# EAGLE design MODUL_RELAIS_8_V101 (EAGLE 6.4)

## Sheet 1 of 2
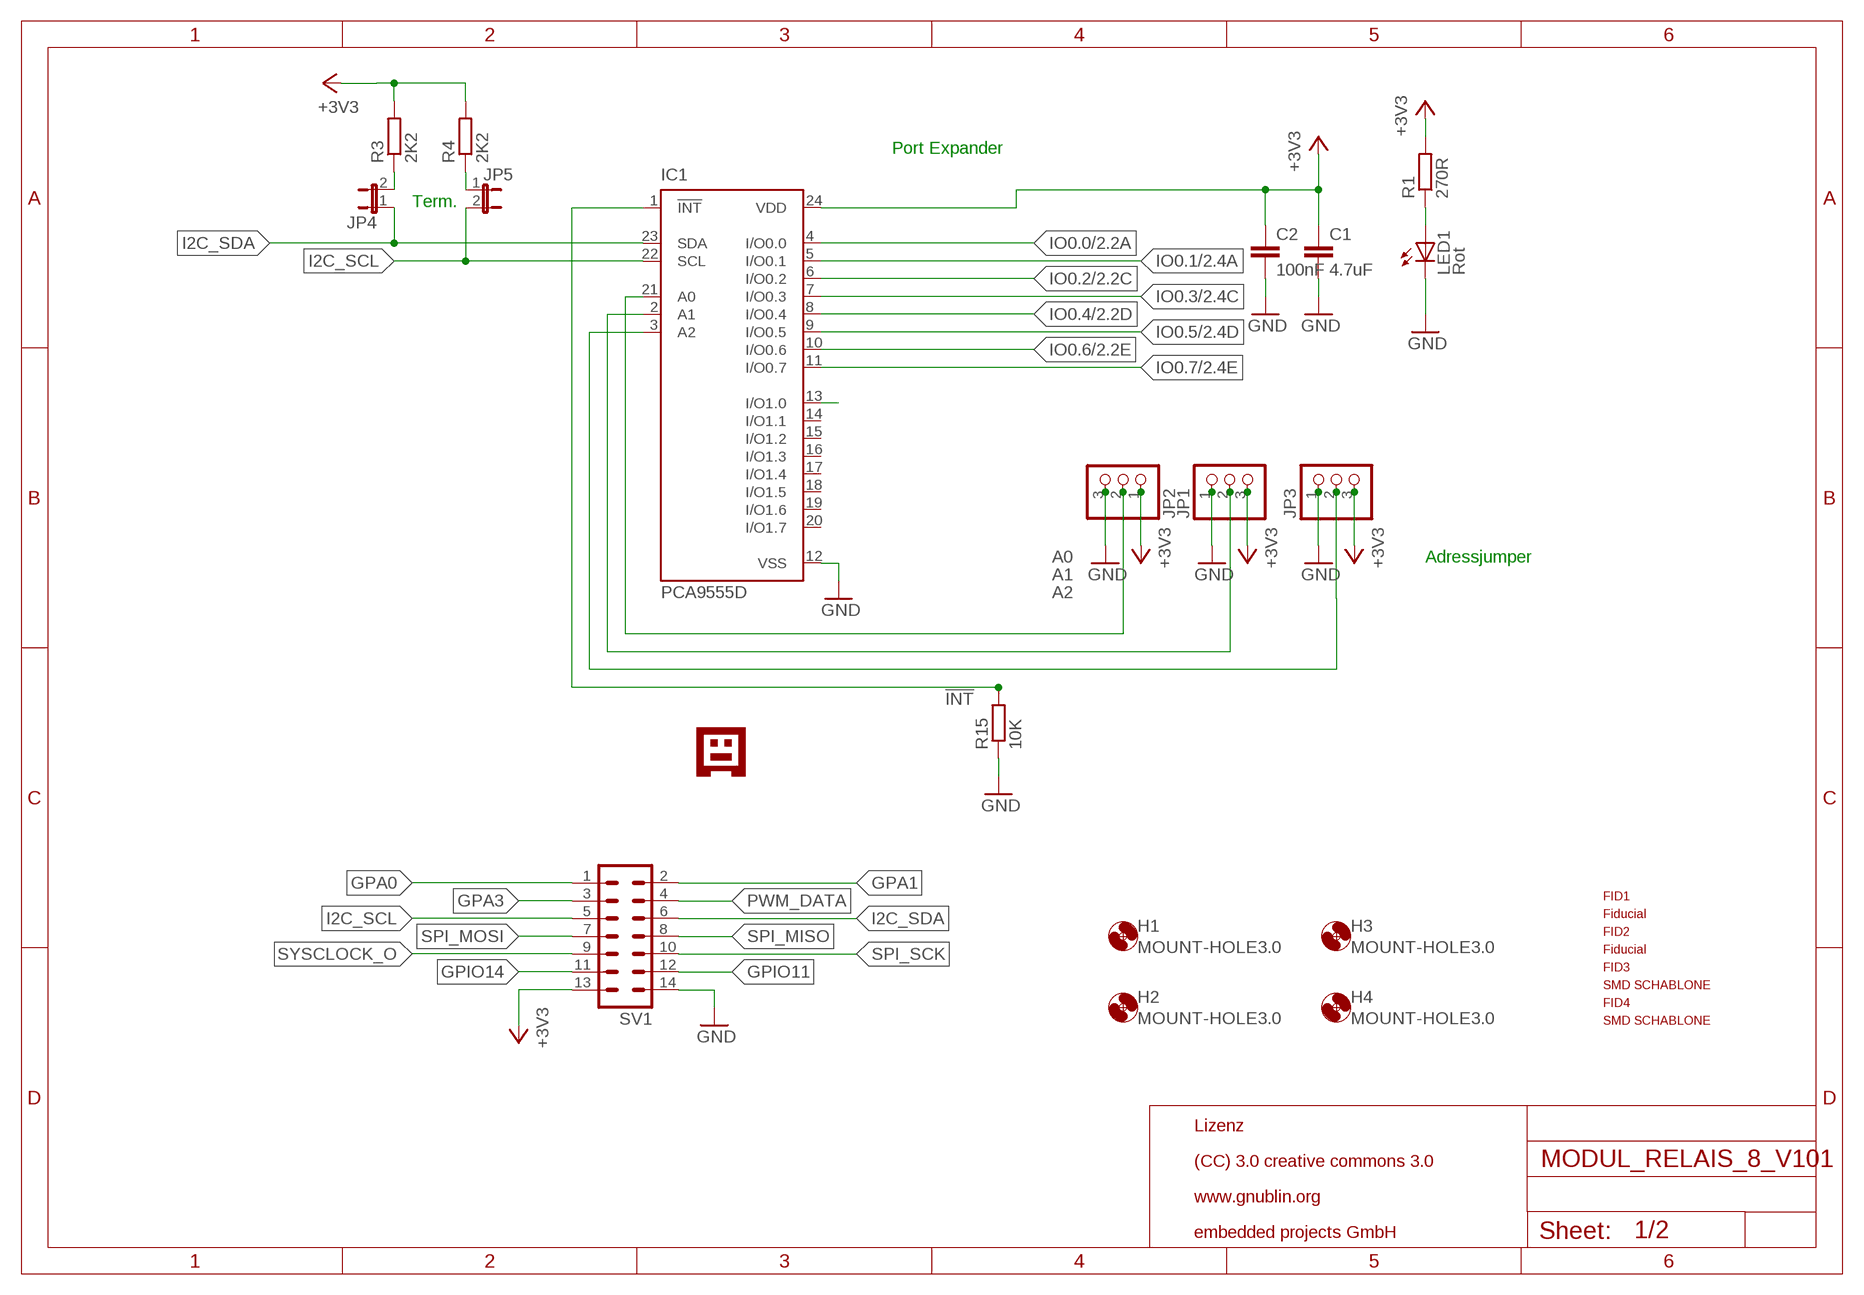
[diagram p0: schematic, sheet 1]

### Parts
C1  4.7uF  C-EUC0805  [C0805]
C2  100nF  C-EUC0805  [C0805]
FID1  PASSERMARKEN_FIDUCIAL  [PASSERMARKEN_FIDUCIAL]
FID2  PASSERMARKEN_FIDUCIAL  [PASSERMARKEN_FIDUCIAL]
FID3  PASSERMARKEN_FIDUCIAL  [PASSERMARKEN_FIDUCIAL]
FID4  PASSERMARKEN_FIDUCIAL  [PASSERMARKEN_FIDUCIAL]
H1  MOUNT-HOLE3.0  [3,0]
H2  MOUNT-HOLE3.0  [3,0]
H3  MOUNT-HOLE3.0  [3,0]
H4  MOUNT-HOLE3.0  [3,0]
IC1  PCA9555D  [SO24]
JP1  PINHD-1X3  [1X03]
JP2  PINHD-1X3  [1X03]
JP3  PINHD-1X3  [1X03]
JP4  JP1E  [JP1]
JP5  JP1E  [JP1]
LED1  Rot  LEDCHIP-LED0805  [CHIP-LED0805]
R1  270R  R-EU_R0805  [R0805]
R3  2K2  R-EU_R0805  [R0805]
R4  2K2  R-EU_R0805  [R0805]
R15  10K  R-EU_R0805  [R0805]
SV1  ML14  [ML14]
U$1  GNUBLINLOGOSIEB  [GNUSIEBDRUCK]

### Nets
!INT: IC1.1(!INT) R15.2
+3V3: C1.1 C2.1 IC1.24(VDD) JP1.3 JP2.1 JP3.3 R1.2 R3.2 R4.2 SV1.13 ; also sheet 2
A0: IC1.21(A0) JP2.2
A1: IC1.2(A1) JP1.2
A2: IC1.3(A2) JP3.2
GND: C1.2 C2.2 IC1.12(VSS) JP1.1 JP2.3 JP3.1 LED1.C R15.1 SV1.14 ; also sheet 2
GPA0: SV1.1
GPA1: SV1.2
GPA3: SV1.3
GPIO11: SV1.12
GPIO14: SV1.11
I2C_SCL: IC1.22(SCL) JP5.2 SV1.5
I2C_SDA: IC1.23(SDA) JP4.1 SV1.6
IO0.0: IC1.4(I/O0.0) ; also sheet 2
IO0.1: IC1.5(I/O0.1) ; also sheet 2
IO0.2: IC1.6(I/O0.2) ; also sheet 2
IO0.3: IC1.7(I/O0.3) ; also sheet 2
IO0.4: IC1.8(I/O0.4) ; also sheet 2
IO0.5: IC1.9(I/O0.5) ; also sheet 2
IO0.6: IC1.10(I/O0.6) ; also sheet 2
IO0.7: IC1.11(I/O0.7) ; also sheet 2
IO1.0: IC1.13(I/O1.0)
N$1: JP4.2 R3.1
N$2: LED1.A R1.1
N$5: JP5.1 R4.1
PWM_DATA: SV1.4
SPI_MISO: SV1.8
SPI_MOSI: SV1.7
SPI_SCK: SV1.10
SYSCLOCK_O: SV1.9
Unconnected: IC1.14(I/O1.1) IC1.15(I/O1.2) IC1.16(I/O1.3) IC1.17(I/O1.4) IC1.18(I/O1.5) IC1.19(I/O1.6) IC1.20(I/O1.7)

### Notes on the sheet
- Port Expander
- Term.
- Adressjumper
- Lizenz
- (CC) 3.0 creative commons 3.0
- www.gnublin.org
- embedded projects GmbH

## Sheet 2 of 2
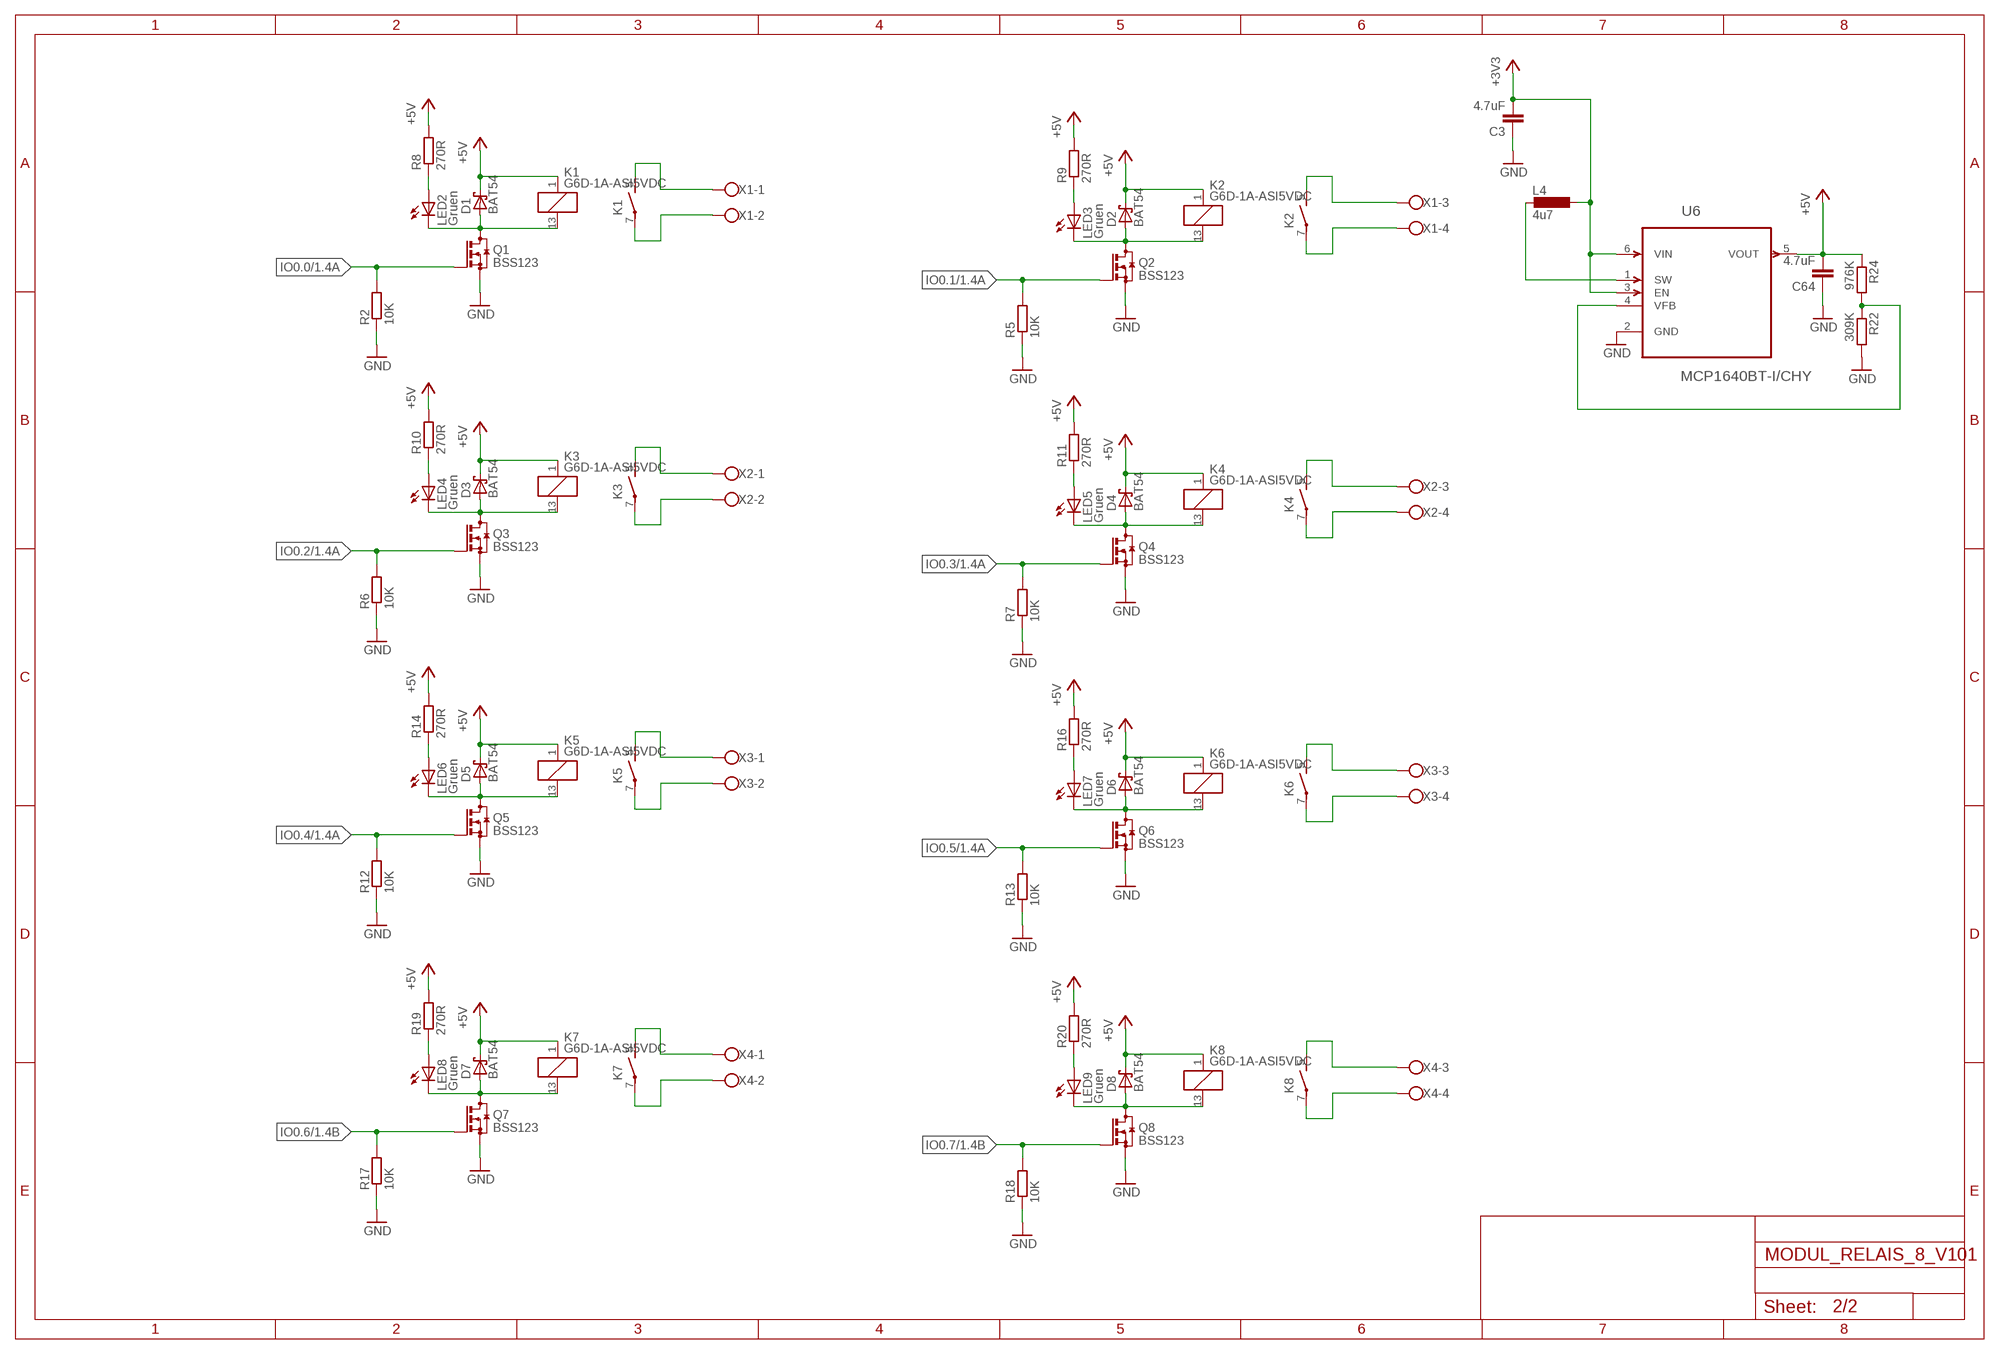
[diagram p1: schematic, sheet 2]

### Parts
C3  4.7uF  C-EUC0805  [C0805]
C64  4.7uF  C-EUC0805  [C0805]
D1  BAT54  DIODE_BAT54  [DIODE_SOT23]
D2  BAT54  DIODE_BAT54  [DIODE_SOT23]
D3  BAT54  DIODE_BAT54  [DIODE_SOT23]
D4  BAT54  DIODE_BAT54  [DIODE_SOT23]
D5  BAT54  DIODE_BAT54  [DIODE_SOT23]
D6  BAT54  DIODE_BAT54  [DIODE_SOT23]
D7  BAT54  DIODE_BAT54  [DIODE_SOT23]
D8  BAT54  DIODE_BAT54  [DIODE_SOT23]
K1  G6D-1A-ASI5VDC  RELAY_G6D-1A-ASI5VDC  [RELAY_G6D]
K2  G6D-1A-ASI5VDC  RELAY_G6D-1A-ASI5VDC  [RELAY_G6D]
K3  G6D-1A-ASI5VDC  RELAY_G6D-1A-ASI5VDC  [RELAY_G6D]
K4  G6D-1A-ASI5VDC  RELAY_G6D-1A-ASI5VDC  [RELAY_G6D]
K5  G6D-1A-ASI5VDC  RELAY_G6D-1A-ASI5VDC  [RELAY_G6D]
K6  G6D-1A-ASI5VDC  RELAY_G6D-1A-ASI5VDC  [RELAY_G6D]
K7  G6D-1A-ASI5VDC  RELAY_G6D-1A-ASI5VDC  [RELAY_G6D]
K8  G6D-1A-ASI5VDC  RELAY_G6D-1A-ASI5VDC  [RELAY_G6D]
L4  4u7  PSU3014  [PSU3014]
LED2  Gruen  LEDCHIP-LED0805  [CHIP-LED0805]
LED3  Gruen  LEDCHIP-LED0805  [CHIP-LED0805]
LED4  Gruen  LEDCHIP-LED0805  [CHIP-LED0805]
LED5  Gruen  LEDCHIP-LED0805  [CHIP-LED0805]
LED6  Gruen  LEDCHIP-LED0805  [CHIP-LED0805]
LED7  Gruen  LEDCHIP-LED0805  [CHIP-LED0805]
LED8  Gruen  LEDCHIP-LED0805  [CHIP-LED0805]
LED9  Gruen  LEDCHIP-LED0805  [CHIP-LED0805]
Q1  BSS123  TRANSISTOR-SMALL-SIGNAL_BSS123  [TRANSISTOR-SMALL-SIGNAL_SOT23]
Q2  BSS123  TRANSISTOR-SMALL-SIGNAL_BSS123  [TRANSISTOR-SMALL-SIGNAL_SOT23]
Q3  BSS123  TRANSISTOR-SMALL-SIGNAL_BSS123  [TRANSISTOR-SMALL-SIGNAL_SOT23]
Q4  BSS123  TRANSISTOR-SMALL-SIGNAL_BSS123  [TRANSISTOR-SMALL-SIGNAL_SOT23]
Q5  BSS123  TRANSISTOR-SMALL-SIGNAL_BSS123  [TRANSISTOR-SMALL-SIGNAL_SOT23]
Q6  BSS123  TRANSISTOR-SMALL-SIGNAL_BSS123  [TRANSISTOR-SMALL-SIGNAL_SOT23]
Q7  BSS123  TRANSISTOR-SMALL-SIGNAL_BSS123  [TRANSISTOR-SMALL-SIGNAL_SOT23]
Q8  BSS123  TRANSISTOR-SMALL-SIGNAL_BSS123  [TRANSISTOR-SMALL-SIGNAL_SOT23]
R2  10K  R-EU_R0805  [R0805]
R5  10K  R-EU_R0805  [R0805]
R6  10K  R-EU_R0805  [R0805]
R7  10K  R-EU_R0805  [R0805]
R8  270R  R-EU_R0805  [R0805]
R9  270R  R-EU_R0805  [R0805]
R10  270R  R-EU_R0805  [R0805]
R11  270R  R-EU_R0805  [R0805]
R12  10K  R-EU_R0805  [R0805]
R13  10K  R-EU_R0805  [R0805]
R14  270R  R-EU_R0805  [R0805]
R16  270R  R-EU_R0805  [R0805]
R17  10K  R-EU_R0805  [R0805]
R18  10K  R-EU_R0805  [R0805]
R19  270R  R-EU_R0805  [R0805]
R20  270R  R-EU_R0805  [R0805]
R22  309K  R-EU_R0805  [R0805]
R24  976K  R-EU_R0805  [R0805]
U6  MCP1640BT-I/CHY  [SOT95P270X145-6N]
X1  W237-04P  [W237-4P]
X2  W237-04P  [W237-4P]
X3  W237-04P  [W237-4P]
X4  W237-04P  [W237-4P]

### Nets
+3V3: C3.2 L4.2 U6.3(EN) U6.6(VIN) ; also sheet 1
+5V: C64.2 D1.3(C) D2.3(C) D3.3(C) D4.3(C) D5.3(C) D6.3(C) D7.3(C) D8.3(C) K1.1 K2.1 K3.1 K4.1 K5.1 K6.1 K7.1 K8.1 R8.2 R9.2 R10.2 R11.2 R14.2 R16.2 R19.2 R20.2 R24.1 U6.5(VOUT)
ENABLE_5V: L4.1 U6.1(SW)
GND: C3.1 C64.1 Q1.2(S) Q2.2(S) Q3.2(S) Q4.2(S) Q5.2(S) Q6.2(S) Q7.2(S) Q8.2(S) R2.1 R5.1 R6.1 R7.1 R12.1 R13.1 R17.1 R18.1 R22.2 U6.2(GND) ; also sheet 1
IO0.0: Q1.1(G) R2.2 ; also sheet 1
IO0.1: Q2.1(G) R5.2 ; also sheet 1
IO0.2: Q3.1(G) R6.2 ; also sheet 1
IO0.3: Q4.1(G) R7.2 ; also sheet 1
IO0.4: Q5.1(G) R12.2 ; also sheet 1
IO0.5: Q6.1(G) R13.2 ; also sheet 1
IO0.6: Q7.1(G) R17.2 ; also sheet 1
IO0.7: Q8.1(G) R18.2 ; also sheet 1
N$3: D1.1(A) K1.13 LED2.C Q1.3(D)
N$4: LED2.A R8.1
N$6: D2.1(A) K2.13 LED3.C Q2.3(D)
N$7: LED3.A R9.1
N$8: K1.5(2:S) X1.1
N$9: K1.7(2:P) X1.2
N$10: K2.5(2:S) X1.3
N$11: K2.7(2:P) X1.4
N$12: D3.1(A) K3.13 LED4.C Q3.3(D)
N$13: D4.1(A) K4.13 LED5.C Q4.3(D)
N$14: LED4.A R10.1
N$15: LED5.A R11.1
N$16: K3.5(2:S) X2.1
N$17: K3.7(2:P) X2.2
N$18: K4.5(2:S) X2.3
N$19: K4.7(2:P) X2.4
N$20: D5.1(A) K5.13 LED6.C Q5.3(D)
N$21: D6.1(A) K6.13 LED7.C Q6.3(D)
N$22: LED6.A R14.1
N$23: LED7.A R16.1
N$24: K5.5(2:S) X3.1
N$25: K5.7(2:P) X3.2
N$26: K6.5(2:S) X3.3
N$27: K6.7(2:P) X3.4
N$28: D7.1(A) K7.13 LED8.C Q7.3(D)
N$29: D8.1(A) K8.13 LED9.C Q8.3(D)
N$30: LED8.A R19.1
N$31: LED9.A R20.1
N$32: K7.5(2:S) X4.1
N$33: K7.7(2:P) X4.2
N$34: K8.5(2:S) X4.3
N$35: K8.7(2:P) X4.4
N$50: R22.1 R24.2 U6.4(VFB)

## Library data of the parts
C1-C3 C64 = rcl:C-EU: CAPACITOR, European symbol
D1-D8 = 20110426_ECP_XMEGABOARD_V102:DIODE_BAT54: Schottky Diodes Source: Fairchild .. BAT54.pdf
FID1 FID2 = KUBUS3:PASSERMARKEN_FIDUCIAL: SMD Passermarke
FID3 FID4 = SMDSCHABLONE:PASSERMARKEN_FIDUCIAL: SMD Passermarke
H1-H4 = holes:MOUNT-HOLE: MOUNTING HOLE with drill center marker
IC1 = micro-philips:PCA9555: 16-bit I2C and SMBus I/O port with interrupt Source: PCA9555_5.pdf; MPN: PCA9555DW; OC_FARNELL: 8906076; OC_NEWARK: 63K6067
JP1-JP3 = pinhead:PINHD-1X3: PIN HEADER
JP4 JP5 = jumper:JP1E: JUMPER
K1-K8 = 20110426_ECP_XMEGABOARD_V102:RELAY_G6D?*: OMRON Slim, Miniature PCB Relay 17.5 × 6.5 × 12.5 mm with Socked Source: http://ecb.omron.com.sg/pdf/relay/power/G6D.pdf; OC_FARNELL: 9812660; OC_NEWARK: unknown
L4 = KUBUS3B_PARTS2:PSU3014: SMD Power Inductors Shielded
LED1-LED9 = led:LED: LED OSRAM: - CHIPLED LG R971, LG N971, LY N971, LG Q971, LY Q971, LO R971, LY R971 LH N974, LH R974 LS Q976, LO Q976, LY Q976 LO Q996 - Hyper CHIPLED LW Q18S LB Q993, LB Q99A, LB R99A - SideLED LS A670, LO A670, LY A670, LG A670, LP A670 LB A673, LV A673, LT A673, LW A673 LH A674 LY A675 LS A676, LA A676, LO A676, LY A676, LW A676 LS A679, LY A679, LG A679 - Hyper Micro SIDELED® LS Y876, LA Y876, LO Y876, LY Y876 LT Y87S - SmartLED LW L88C, LW L88S LB L89C, LB L89S, LG L890 LS L89K, LO L89K, LY L89K LS L896, LA L896, LO L896, LY L896 - TOPLED LS T670, LO T670, LY T670, LG T670, LP T670 LSG T670, LSP T670, LSY T670, LOP T670, LYG T670 LG T671, LOG T671, LSG T671 LB T673, LV T673, LT T673, LW T673 LH T674 LS T676, LA T676, LO T676, LY T676, LB T676, LH T676, LSB T676, LW T676 LB T67C, LV T67C, LT T67C, LS T67K, LO T67K, LY T67K, LW E67C LS E67B, LA E67B, LO E67B, LY E67B, LB E67C, LV E67C, LT E67C LW T67C LS T679, LY T679, LG T679 LS T770, LO T770, LY T770, LG T770, LP T770 LB T773, LV T773, LT T773, LW T773 LH T774 LS E675, LA E675, LY E675, LS T675 LS T776, LA T776, LO T776, LY T776, LB T776 LHGB T686 LT T68C, LB T68C - Hyper Mini TOPLED® LB M676 - Mini TOPLED Santana® LG M470 LS M47K, LO M47K, LY M47K Source: http://www.osram.convergy.de LUXEON: - LUMILED® LXK2-PW12-R00, LXK2-PW12-S00, LXK2-PW14-U00, LXK2-PW14-V00 LXK2-PM12-R00, LXK2-PM12-S00, LXK2-PM14-U00 LXK2-PE12-Q00, LXK2-PE12-R00, LXK2-PE12-S00, LXK2-PE14-T00, LXK2-PE14-U00 LXK2-PB12-K00, LXK2-PB12-L00, LXK2-PB12-M00, LXK2-PB14-N00, LXK2-PB14-P00, LXK2-PB14-Q00 LXK2-PR12-L00, LXK2-PR12-M00, LXK2-PR14-Q00, LXK2-PR14-R00 LXK2-PD12-Q00, LXK2-PD12-R00, LXK2-PD12-S00 LXK2-PH12-R00, LXK2-PH12-S00 LXK2-PL12-P00, LXK2-PL12-Q00, LXK2-PL12-R00 Source: www.luxeon.com KINGBRIGHT: KA-3528ASYC Source: www.kingbright.com
Q1-Q8 = 20110426_ECP_XMEGABOARD_V102:TRANSISTOR-SMALL-SIGNAL_BSS123: N-CHANNEL MOS FET
R1-R20 R22 R24 = rcl:R-EU_: RESISTOR, European symbol
SV1 = con-ml:ML14: HARTING; OC_FARNELL: unknown; OC_NEWARK: unknown
U6 = mcp1640:MCP1640BT-I/CHY: Synchronous Boost Regulator; MPN: MCP1640BT-I/CHY; OC_FARNELL: 1800207; OC_NEWARK: 73R3625; PACKAGE: SOT-6; SUPPLIER: Microchip
U$1 = EmbeddedProjectsLogos2:GNUBLINLOGO
X1-X4 = con-wago-508:W237-04P: WAGO SREW CLAMP

## Net classes
2 5V: width 0.2 mm, clearance 0.15 mm

## Board
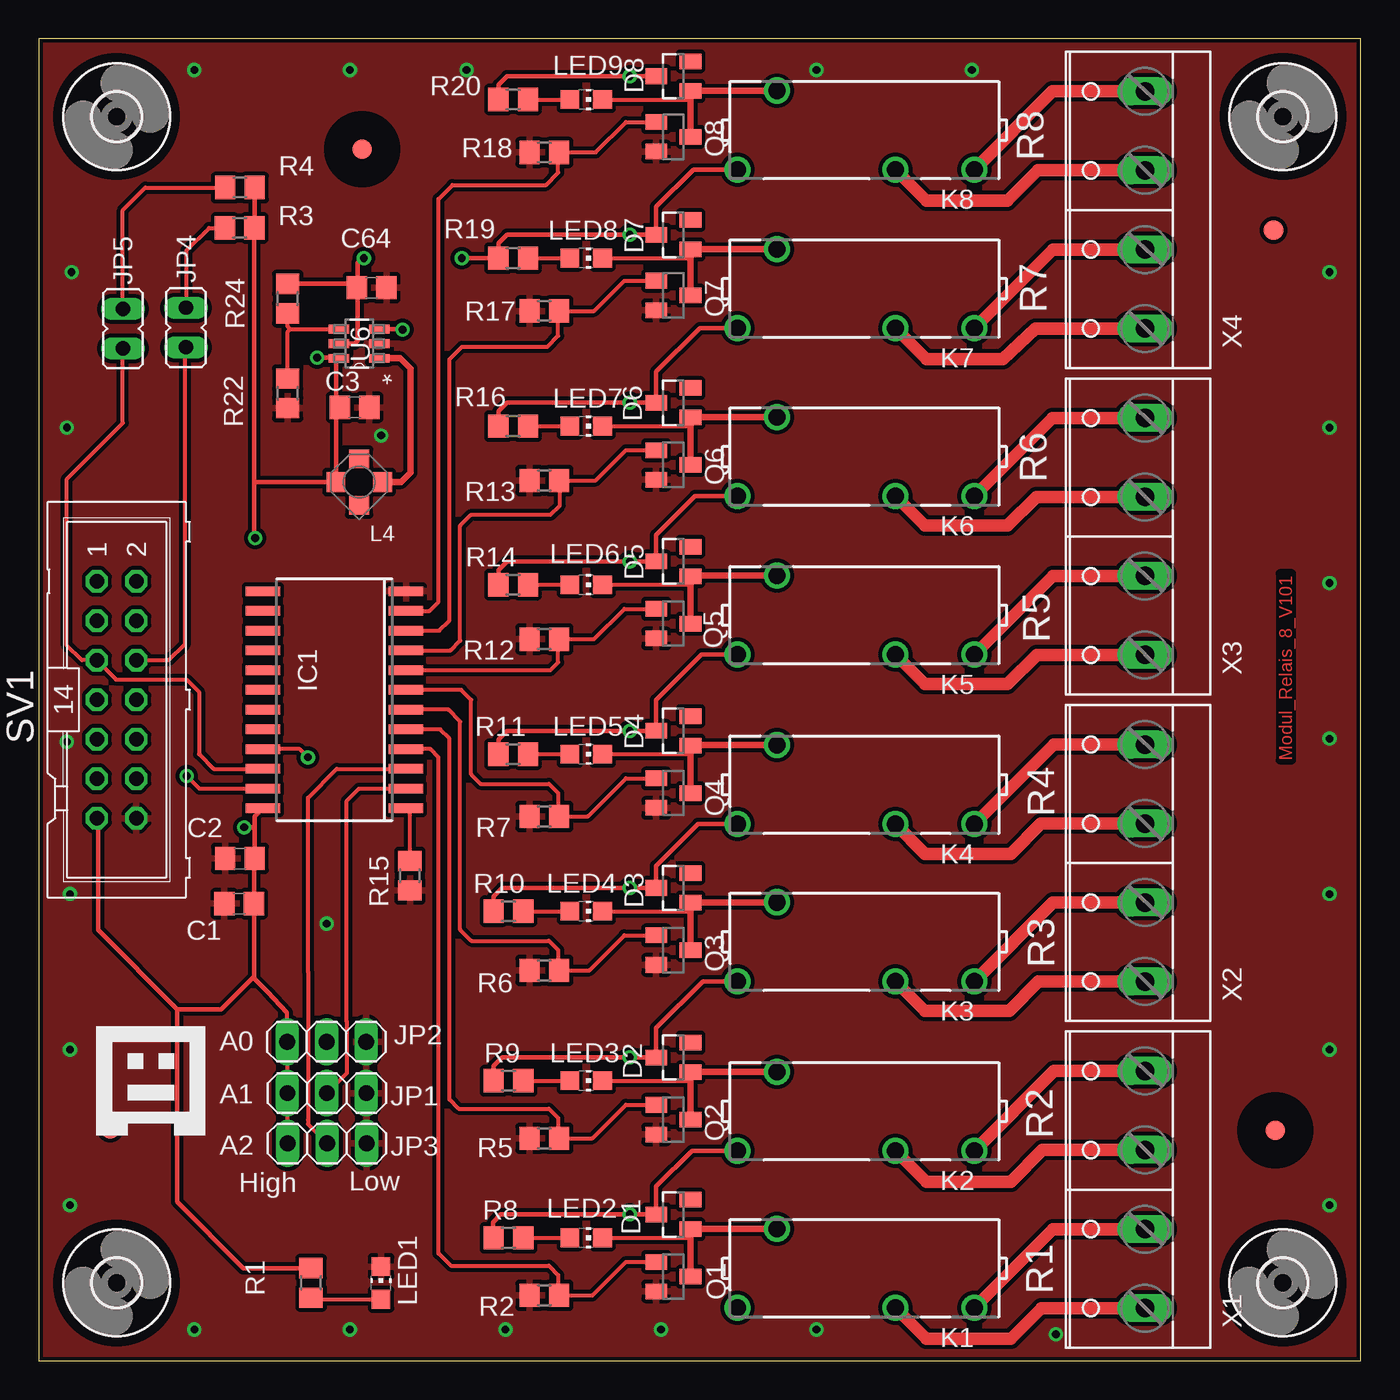
[diagram p2: board, top side]
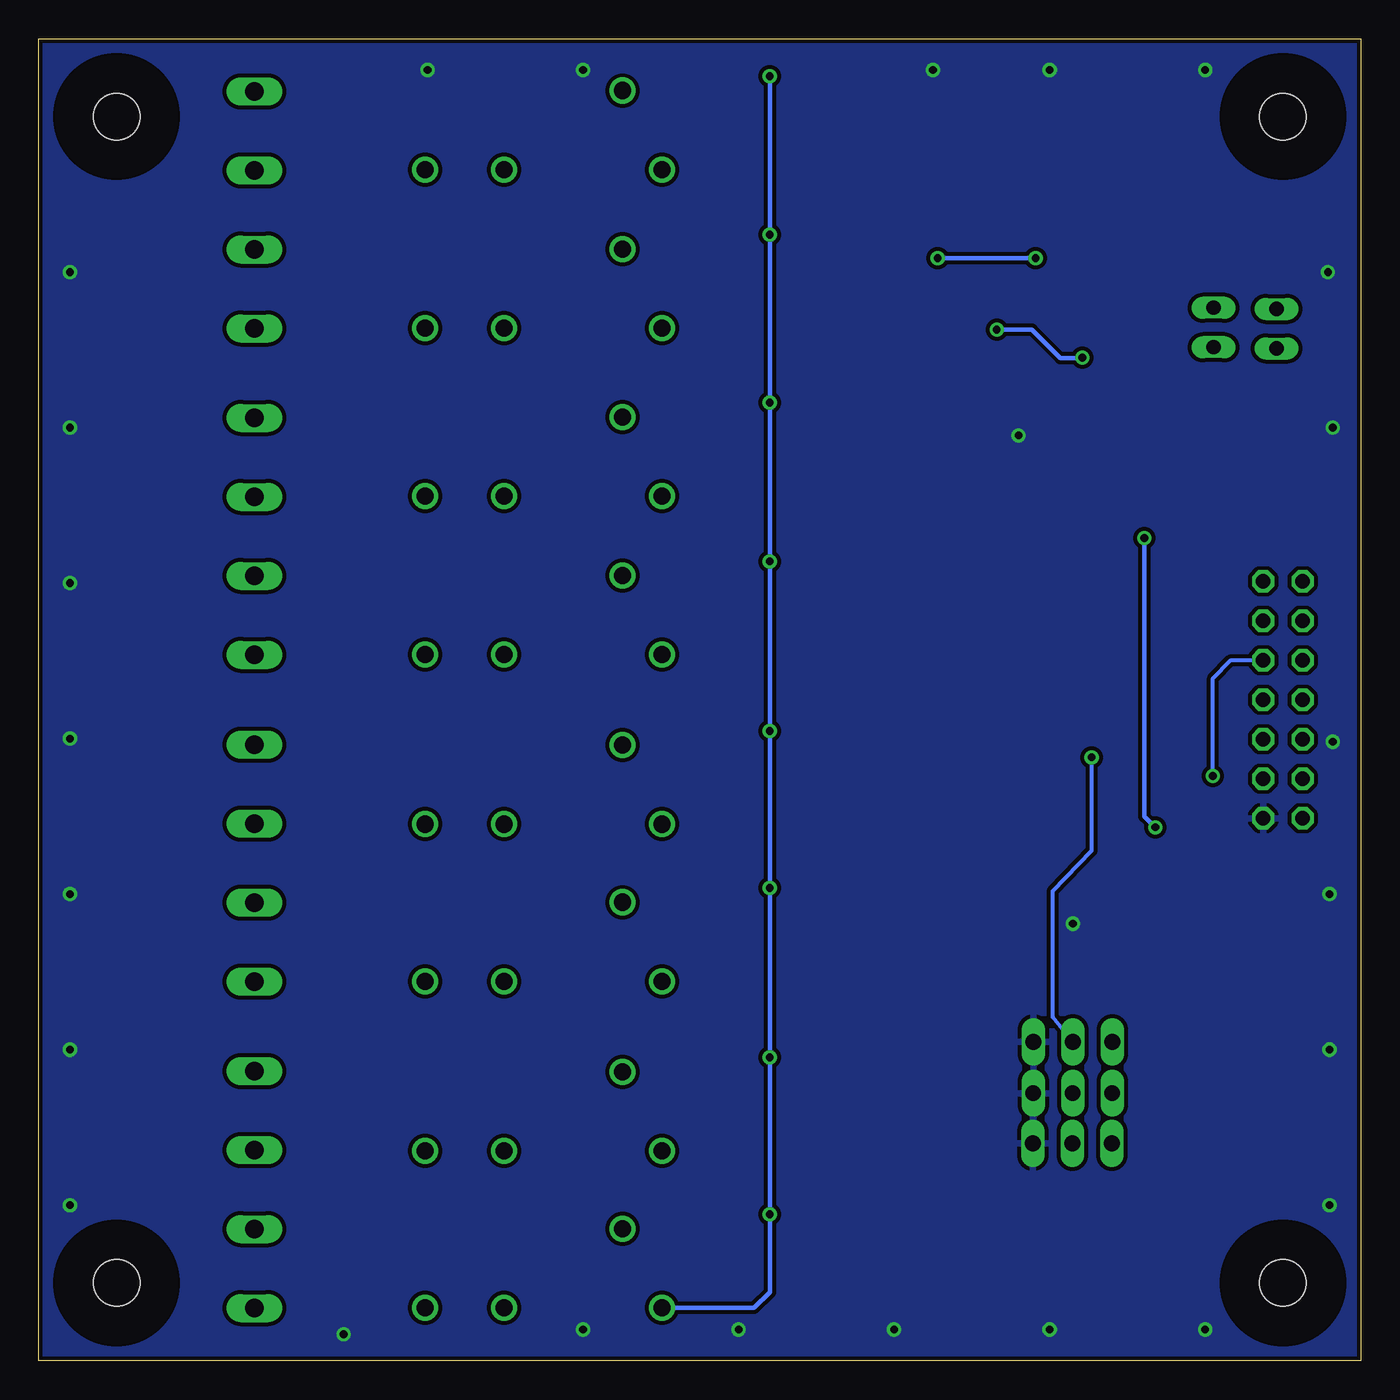
[diagram p3: board, bottom side, seen from below]

Size 85 x 85 mm. Coordinates in mm from the lower left corner, seen from the top.
Outline: 0,0 85,0 85,85 0,85 0,0
Copper layers (1*16): Top 0.035mm / dielectric 1.5mm / Bottom 0.035mm
Design rules "default *": minimum track width 10mil, minimum drill 24mil, track to track 10mil, track to pad 10mil, pad to pad 10mil, via to via 10mil, smd to smd 8mil, copper to edge 10mil, drill to drill 8mil, minimum pad ring 10mil, minimum via ring 8mil, stop-mask expansion 2mil, vias tented up to drill 40mil, thermal gap 10mil

### Footprints (pad centres in the part's own frame; a part is rotated, then mirrored left to right if it is on the bottom)
C0805 = smd 1.3 x 1.5: 1 -0.95,0; 2 0.95,0
DIODE_SOT23 = smd 1 x 1.4: 1 -0.95,-1.1; 2 0.95,-1.1; 3 0,1.1
PASSERMARKEN_FIDUCIAL = smd 1.27 x 1.27: 1 0,0
3,0 = hole 3: 0,0
SO24 = smd 0.6 x 2.2: 1 -6.985,-4.6; 2 -5.715,-4.6; 3 -4.445,-4.6; 4 -3.175,-4.6; 5 -1.905,-4.6; 6 -0.635,-4.6; 7 0.635,-4.6; 8 1.905,-4.6; 9 3.175,-4.6; 10 4.445,-4.6; 11 5.715,-4.6; 12 6.985,-4.6; 13 6.985,4.6; 14 5.715,4.6; 15 4.445,4.6; 16 3.175,4.6; 17 1.905,4.6; 18 0.635,4.6; 19 -0.635,4.6; 20 -1.905,4.6; 21 -3.175,4.6; 22 -4.445,4.6; 23 -5.715,4.6; 24 -6.985,4.6
1X03 = drill 1.016 long: 1 -2.54,0; 2 0,0; 3 2.54,0
JP1 = drill 0.914 long: 1 0,-1.27; 2 0,1.27
RELAY_G6D = drill 1.1 pad 1.676: 1 8.08,2.5; 5 -2.08,2.5; 7 -7.16,2.5; 13 5.54,-2.58
PSU3014 = smd 1.2 x 1.3: 1 -1.5,0; 2 1.5,0 | smd 1.3 x 1.2: 3 0,1.5; 4 0,-1.5
CHIP-LED0805 = smd 1.2 x 1.2: A 0,-1.05; C 0,1.05
TRANSISTOR-SMALL-SIGNAL_SOT23 = smd 1 x 1.4: 1 -0.95,-1.1; 2 0.95,-1.1; 3 0,1.1
R0805 = smd 1.3 x 1.5: 1 -0.95,0; 2 0.95,0
ML14 = drill 0.914 octagon: 1 -7.62,-1.27; 2 -7.62,1.27; 3 -5.08,-1.27; 4 -5.08,1.27; 5 -2.54,-1.27; 6 -2.54,1.27; 7 0,-1.27; 8 0,1.27; 9 2.54,-1.27; 10 2.54,1.27; 11 5.08,-1.27; 12 5.08,1.27; 13 7.62,-1.27; 14 7.62,1.27
SOT95P270X145-6N = smd 1.321 x 0.559: 1 -1.295,0.94; 2 -1.295,0; 3 -1.295,-0.94; 4 1.295,-0.94; 5 1.295,0; 6 1.295,0.94
W237-4P = drill 1.194 long: 1 -7.62,-0.635; 2 -2.54,-0.635; 3 2.54,-0.635; 4 7.62,-0.635

### Placement (x,y rotation side)
C1  12.88,29.39 180 top
C2  12.93,32.29 180 top
C3  20.3,61.3 180 top
C64  21.4,69 180 top
D1  40.8,9.4 90 top
D2  40.8,19.5 90 top
D3  40.8,30.4 90 top
D4  40.8,40.5 90 top
D5  40.8,51.4 90 top
D6  40.8,61.6 90 top
D7  40.8,72.4 90 top
D8  40.8,82.6 90 top
FID1  79.5,14.8 0 top
FID2  20.8,77.9 0 top
FID3  79.4,72.7 0 top
FID4  4.6,14.9 0 top
H1  5,5 0 top
H2  80,80 0 top
H3  80,5 0 top
H4  5,80 0 top
IC1  19,42.5 90 top
JP1  18.52,17.2 180 top
JP2  18.5,20.5 0 top
JP3  18.53,13.97 180 top
JP4  9.45,66.44 0 top
JP5  5.4,66.36 180 top
K1  53,5.9 180 top
K2  53,16 180 top
K3  53,26.9 180 top
K4  53,37 180 top
K5  53,47.9 180 top
K6  53,58.1 180 top
K7  53,68.9 180 top
K8  53,79.1 180 top
L4  20.6,56.5 180 top
LED1  22,5 0 top
LED2  35.2,7.9 270 top
LED3  35.2,18 270 top
LED4  35.2,28.9 270 top
LED5  35.2,39 270 top
LED6  35.2,49.9 270 top
LED7  35.2,60.1 270 top
LED8  35.2,70.9 270 top
LED9  35.2,81.1 270 top
Q1  40.8,5.4 270 top
Q2  40.8,15.5 270 top
Q3  40.8,26.4 270 top
Q4  40.8,36.5 270 top
Q5  40.8,47.4 270 top
Q6  40.8,57.6 270 top
Q7  40.8,68.5 270 top
Q8  40.8,78.7 270 top
R1  17.5,5 90 top
R2  32.5,4.2 0 top
R3  12.91,72.84 0 top
R4  12.93,75.44 0 top
R5  32.5,14.3 0 top
R6  32.5,25.1 0 top
R7  32.5,35 0 top
R8  30.2,7.9 180 top
R9  30.2,18 180 top
R10  30.2,28.9 180 top
R11  30.5,39 180 top
R12  32.5,46.4 0 top
R13  32.5,56.6 0 top
R14  30.5,49.9 180 top
R15  23.86,31.19 90 top
R16  30.5,60.1 180 top
R17  32.5,67.5 0 top
R18  32.5,77.7 0 top
R19  30.5,70.9 180 top
R20  30.5,81.1 180 top
R22  16,62.2 270 top
R24  16,68.3 270 top
SV1  5,42.5 270 top
U6  20.6,65.4 180 top
U$1  3.7,14.5 0 top
X1  70.5,11 90 top
X2  70.5,32 90 top
X3  70.5,53 90 top
X4  70.5,74 90 top

### Tracks (layer width: path | path; a pad name or v marks a point on that pad's centre or on a via)
!INT
  Top 0.254: R15.2 23.86,35.16 IC1.1
+3V3  (via drill 0.5)
  Top 0.254: 15.92,22.4 15.92,20.54 JP2.1 15.96,17.22 JP1.3 JP3.3
  Top 0.305: R1.2 13.15,5.95 8.9,10.2 8.9,22.6 | 8.9,22.6 3.8,27.7 3.8,34.81 SV1.13 | 13.88,34.3 C2.1 13.83,32.24 C1.1 13.83,24.7 | 13.88,34.3 13.88,34.99 IC1.24 | 13.83,24.7 13.83,24.57 14.7,23.7 15.92,22.4 | 8.9,22.6 11.73,22.6 13.83,24.7 | R4.2 13.88,72.86 R3.2 13.86,56.5 | 13.86,56.5 13.86,52.94 v13.9,52.9 | 13.88,34.3 v13.2,34.3 | 13.86,56.5 L4.2 19.1,61.05 C3.2 19.1,61.55 19.1,64.2 19.3,64.41 U6.6 19.27,64.5 v17.9,64.5 | U6.3 23.26,66.34 v23.4,66.3
  Bottom 0.305: v13.9,52.9 13.9,35 v13.2,34.3 | v23.4,66.3 21.14,66.3 U6.6 18.04,64.46 v17.9,64.5
+5V  (via drill 0.5)
  Top 0.254: R8.2 29.2,7.95
  Top 0.305: K2.1 42,13.5 39.7,11.2 D1.3 38.5,9.4 | v38,9.4 29.7,9.4 29.2,8.9 29.2,7.95 | v38,9.4 38.5,9.4 | v38,9.4 38.5,9.4 | v38,82.6 38.5,82.6 | R9.2 29.25,18.95 29.8,19.5 v38,19.5 D2.3 39.7,21.4 42.7,24.4 K3.1 | 38.5,82.6 30.1,82.6 29.55,82.05 R20.2 | K4.1 42.4,34.5 39.7,31.8 D3.3 v38,30.4 29.8,30.4 29.25,29.85 R10.2 | K6.1 42.2,55.6 39.7,53.1 D5.3 v38,51.4 30.1,51.4 29.55,50.85 R14.2 | K8.1 42.1,76.6 39.7,74.2 D7.3 v38,72.4 30.1,72.4 29.55,71.85 R19.2 v27.2,70.9 | U6.5 20.3,65.4 20.5,65.6 20.5,69.05 C64.2 | 38.5,82.6 D8.3 | v20.9,70.9 20.8,70.9 20.5,70.6 20.5,69.25 C64.2 | K7.1 42.5,66.4 39.7,63.6 D6.3 v38,61.6 30.1,61.6 29.55,61.05 R16.2 | K5.1 42.6,45.4 39.7,42.5 D4.3 v38,40.5 30.1,40.5 29.55,39.95 R11.2 | R24.1 20.2,69.25 C64.2
  Bottom 0.305: v38,82.6 38,72.5 v38,72.4 38,61.7 v38,61.6 v38,51.4 38,40.6 v38,40.5 38,30.5 v38,30.4 38,19.6 v38,19.5 v38,9.4 38,9.3 38,4.4 39,3.4 K1.1 | v27.2,70.9 v20.9,70.9
A0  (via drill 0.5)
  Top 0.254: IC1.21 16.77,39.33 v17.3,38.8
  Bottom 0.254: v17.3,38.8 17.3,32.8 19.8,30.2 19.8,22.1 JP2.2
A1
  Top 0.254: IC1.2 20.59,36.78 19.8,36 19.8,21.8 19.8,18.6 19.8,18.48 JP1.2
A2
  Top 0.254: IC1.3 19.16,38.05 17.3,36.2 17.3,25.04 17.3,25 17.3,15.5 17.3,15.2 JP3.2
ENABLE_5V
  Top 0.406: U6.1 23.24,64.46 23.9,63.8 23.9,57.1 23.3,56.5 L4.1
GND  (via drill 0.5)
  other vias: 10,2 20,2 30,2 83,10 83,20 83,40 83,30 83,60 83,70 40,2 83,50 50,2 65.4,1.7 2,10 2,20 2,30 1.8,39.8 1.8,60 2.1,70 10,83 20,83 27.5,83 50,83 60,83 18.5,28.1 22,59.5
  pour Bottom: -2.7,-3.6 89.2,-3 89.5,89.2 -3.1,88.6
  pour Top: -2.7,-3.3 90,-3.1 90.3,89.6 -2.9,89.2
I2C_SCL
  Top 0.254: JP5.2 5.4,60.3 1.8,56.7 1.8,46 2.76,45.04 SV1.5 4.97,43.8 9.5,43.8 10.3,43 10.3,39 11.24,38.05 IC1.22
I2C_SDA  (via drill 0.5)
  Top 0.254: SV1.6 8.34,45.04 9.4,46.1 9.4,65.12 JP4.1 | IC1.23 10.31,36.78 v9.5,37.6
  Bottom 0.254: v9.5,37.6 9.5,43.88 8.34,45.04 6.8,45.04 SV1.6
IO0.0
  Top 0.254: Q1.1 37.75,6.35 35.6,4.2 R2.2 33.4,4.55 33.4,5.5 32.8,6.1 26.5,6.1 25.7,6.9 25.7,38.8 25.18,39.33 IC1.4
IO0.1
  Top 0.254: Q2.1 37.75,16.45 35.6,14.3 R5.2 33.4,14.55 33.4,15.6 32.8,16.2 27,16.2 26.4,16.8 26.4,40 25.8,40.59 IC1.5
IO0.2
  Top 0.254: Q3.1 37.65,27.35 35.4,25.1 R6.2 33.4,25.45 33.4,26.4 32.8,27 27.8,27 27.1,27.7 27.1,41.1 26.34,41.87 IC1.6
IO0.3
  Top 0.254: Q4.1 37.75,37.45 35.3,35 R7.2 33.4,35.55 33.4,36.5 32.8,37.1 28.4,37.1 27.8,37.7 27.8,42.5 27.16,43.13 IC1.7
IO0.4
  Top 0.254: Q5.1 37.65,48.35 35.7,46.4 R12.2 33.4,46.35 33.4,44.9 32.91,44.41 IC1.8
IO0.5
  Top 0.254: Q6.1 37.75,58.55 35.8,56.6 R13.2 33.5,56.55 33.5,55 32.9,54.4 27.8,54.4 27.1,53.7 27.1,46.3 26.48,45.67 IC1.9
IO0.6
  Top 0.254: Q7.1 37.65,69.45 35.7,67.5 R17.2 33.4,67.45 33.4,65.9 32.7,65.2 27.2,65.2 26.4,64.4 26.4,47.6 25.75,46.95 IC1.10
IO0.7
  Top 0.254: Q8.1 37.75,79.65 35.8,77.7 R18.2 33.4,77.65 33.4,76.4 32.6,75.6 26.6,75.6 25.7,74.7 25.7,48.8 25.11,48.22 IC1.11
N$1
  Top 0.254: R3.1 10.94,72.84 9.5,71.4 9.5,67.76 JP4.2
N$2
  Top 0.254: LED1.A 17.6,3.95 R1.1
N$3
  Top 0.254: LED2.C 41.9,7.9
  Top 0.406: K1.13 41.93,8.48 D1.1 41.9,7.9 Q1.3
N$4
  Top 0.254: R8.1 LED2.A
N$5
  Top 0.254: R4.1 6.84,75.44 5.4,74 JP5.1
N$6
  Top 0.254: LED3.C 41.9,18
  Top 0.406: K2.13 41.93,18.58 D2.1 41.9,18 Q2.3
N$7
  Top 0.254: R9.1 LED3.A
N$8
  Top 0.813: X1.1 64.48,3.38 62.5,1.4 57.08,1.4 K1.5
N$9
  Top 0.813: X1.2 65.22,8.46 K1.7
N$10
  Top 0.813: X1.3 64.54,13.54 62.5,11.5 57.08,11.5 K2.5
N$11
  Top 0.813: X1.4 65.28,18.62 K2.7
N$12
  Top 0.254: LED4.C 41.9,28.9
  Top 0.406: K3.13 41.93,29.48 D3.1 41.9,28.9 Q3.3
N$13
  Top 0.254: LED5.C 41.9,39
  Top 0.406: K4.13 41.93,39.58 D4.1 41.9,39 Q4.3
N$14
  Top 0.254: R10.1 LED4.A
N$15
  Top 0.254: R11.1 LED5.A
N$16
  Top 0.813: X2.1 64.28,24.38 62.4,22.5 56.98,22.5 K3.5
N$17
  Top 0.813: X2.2 65.22,29.46 K3.7
N$18
  Top 0.813: X2.3 64.44,34.54 62.5,32.6 56.98,32.6 K4.5
N$19
  Top 0.813: X2.4 65.28,39.62 K4.7
N$20
  Top 0.254: LED6.C 41.9,49.9
  Top 0.406: K5.13 41.93,50.48 D5.1 41.9,49.9 Q5.3
N$21
  Top 0.254: LED7.C 41.9,60.1
  Top 0.406: K6.13 41.93,60.68 D6.1 41.9,60.1 Q6.3
N$22
  Top 0.254: R14.1 LED6.A
N$23
  Top 0.254: R16.1 LED7.A
N$24
  Top 0.813: X3.1 64.18,45.38 62.3,43.5 56.98,43.5 K5.5
N$25
  Top 0.813: X3.2 65.22,50.46 K5.7
N$26
  Top 0.813: X3.3 64.14,55.54 62.3,53.7 56.98,53.7 K6.5
N$27
  Top 0.813: X3.4 65.18,60.62 K6.7
N$28
  Top 0.254: LED8.C 41.9,70.9
  Top 0.406: K7.13 41.93,71.48 D7.1 41.9,70.9 Q7.3
N$29
  Top 0.254: LED9.C 41.9,81.1
  Top 0.406: K8.13 41.93,81.68 D8.1 41.9,81.1 Q8.3
N$30
  Top 0.254: R19.1 LED8.A
N$31
  Top 0.254: R20.1 LED9.A
N$32
  Top 0.813: X4.1 64.08,66.38 62,64.4 57.08,64.4 K7.5
N$33
  Top 0.813: X4.2 65.22,71.46 K7.7
N$34
  Top 0.813: X4.3 64.24,76.54 62.3,74.6 57.08,74.6 K8.5
N$35
  Top 0.813: X4.4 65.18,81.62 K8.7
N$50
  Top 0.254: 16.16,66.34 U6.4 | 16.16,66.34 16,66.5 R24.2 | R22.1 16,66.18 16.16,66.34

### Text on the board
Top: Modul_Relais_8_V101
tNames: R8 | R7 | R6 | R5 | R4 | R3 | A0 | A1 | A2 | R2 | High | Low | R1
bDocu: IO0.7 | IO0.6 | SCL | SDA | IO0.5 | IO0.4 | GPA0 | GPA1 | GPA3 | PWM | SDA | SCL | MOSI | MISO | IO0.3 | SCLK | SCK | IO14 | IO11 | +3V3 | GND | IO0.2 | IO0.1 | A2 | A1 | A0 | IO0.0